# EAGLE schematic soundrasp_module (EAGLE 6.5.0)
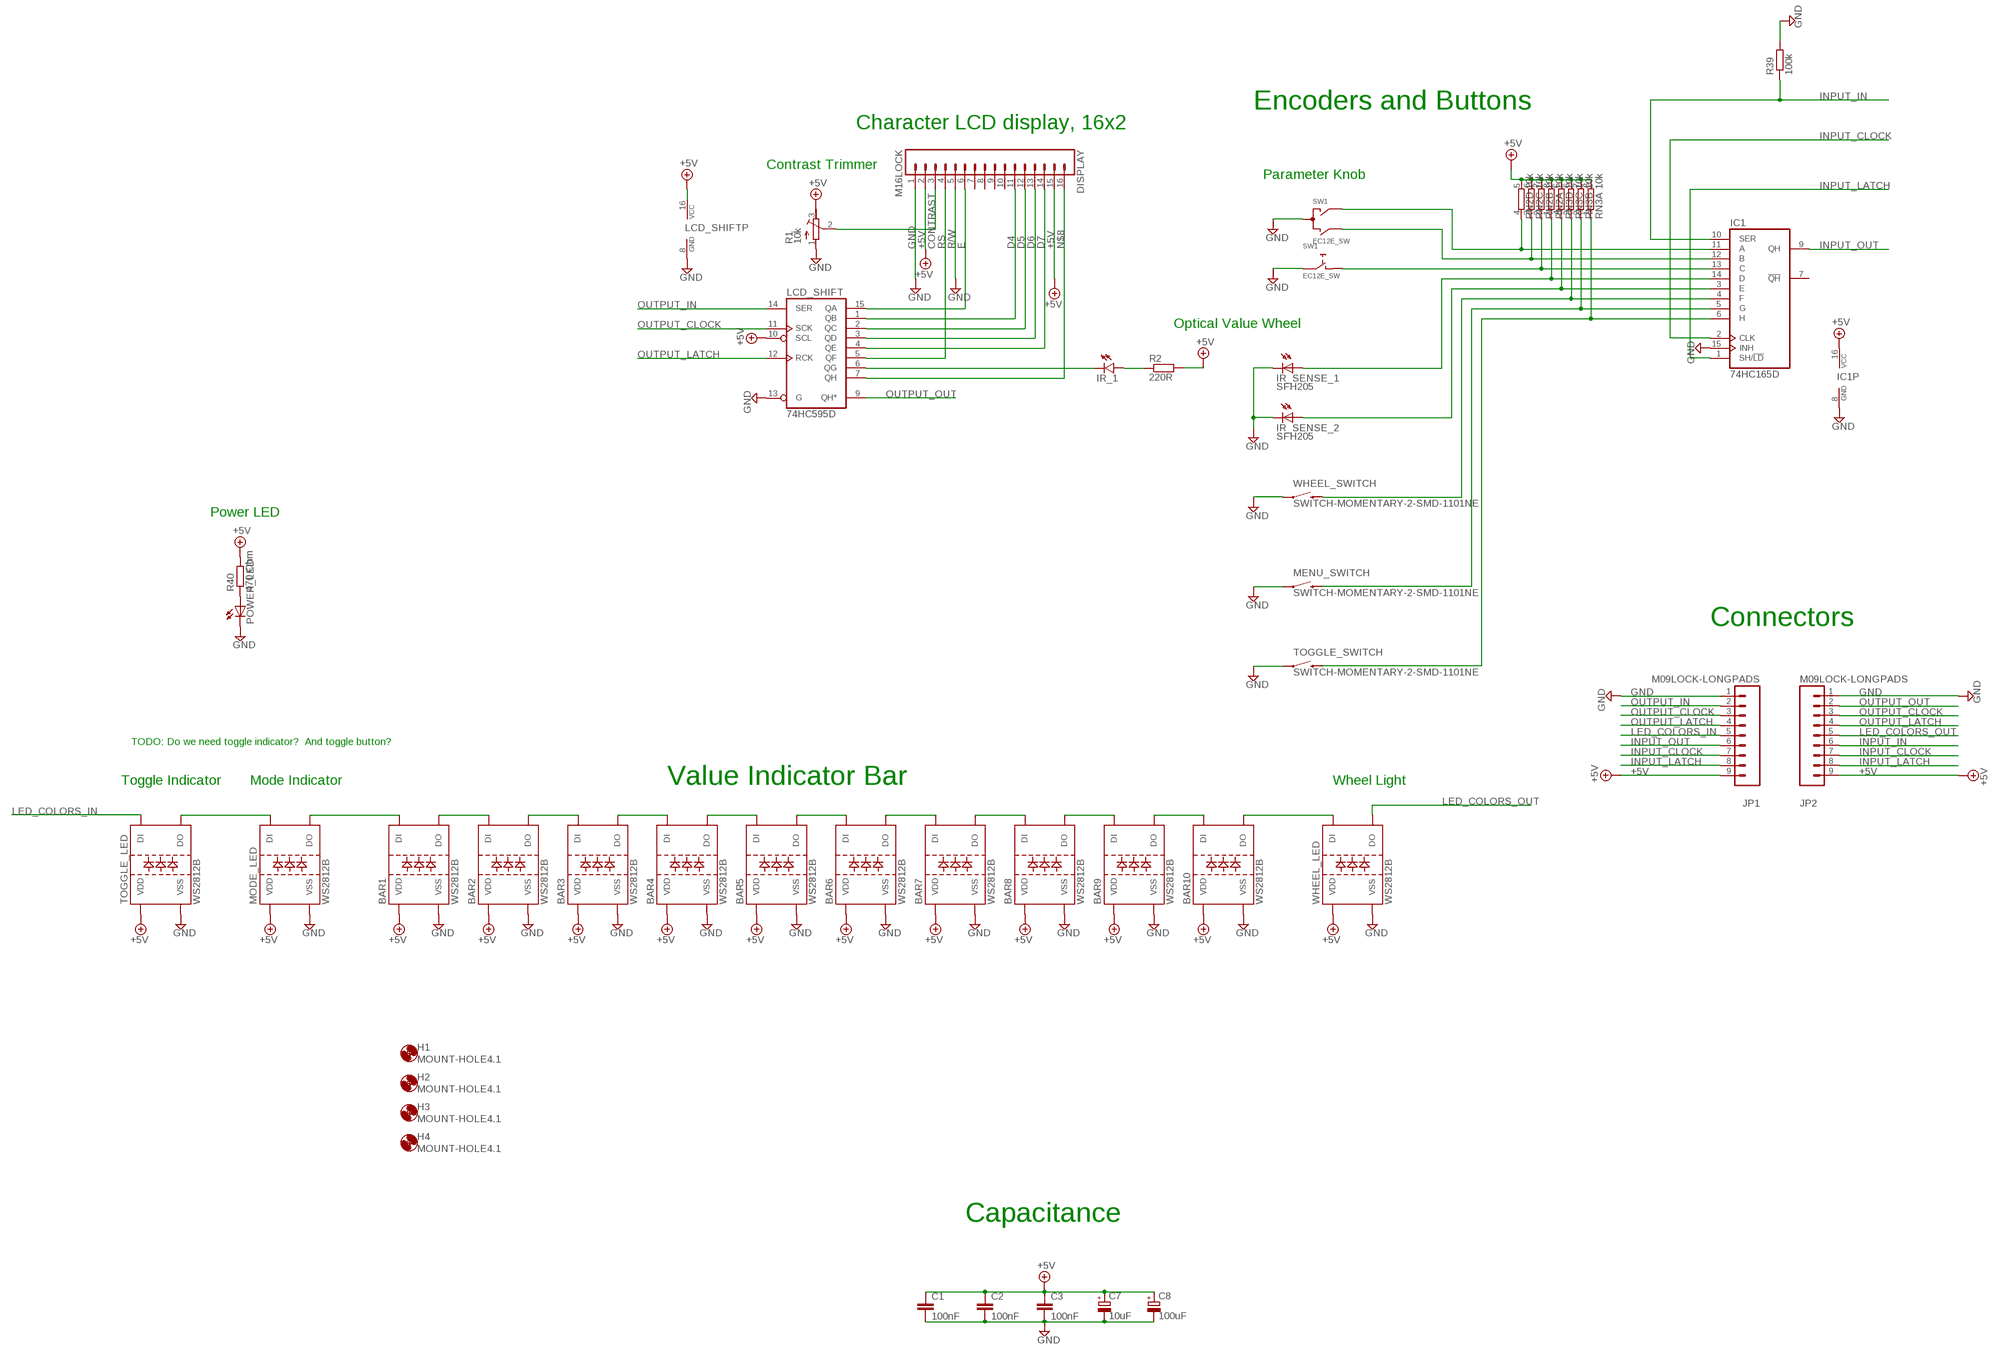
[diagram p0: schematic, sheet 1]

## Parts
BAR1  WS2812B  [WS2812B]
BAR2  WS2812B  [WS2812B]
BAR3  WS2812B  [WS2812B]
BAR4  WS2812B  [WS2812B]
BAR5  WS2812B  [WS2812B]
BAR6  WS2812B  [WS2812B]
BAR7  WS2812B  [WS2812B]
BAR8  WS2812B  [WS2812B]
BAR9  WS2812B  [WS2812B]
BAR10  WS2812B  [WS2812B]
C1  100nF  C-EUC0805  [C0805]
C2  100nF  C-EUC0805  [C0805]
C3  100nF  C-EUC0805  [C0805]
C7  10uF  CPOL-EUE2.5-7  [E2,5-7]
C8  100uF  CPOL-EUE2.5-7  [E2,5-7]
DISPLAY  M16LOCK  [1X16_LOCK]
H1  MOUNT-HOLE4.1  [4,1]
H2  MOUNT-HOLE4.1  [4,1]
H3  MOUNT-HOLE4.1  [4,1]
H4  MOUNT-HOLE4.1  [4,1]
IC1  74HC165D  [SO16]
IR_1  LED3MM  [LED3MM]
IR_SENSE_1  SFH205  [SFH205]
IR_SENSE_2  SFH205  [SFH205]
JP1  M09LOCK-LONGPADS  [1X09_LOCK_LONGPADS]
JP2  M09LOCK-LONGPADS  [1X09_LOCK_LONGPADS]
LCD_SHIFT  74HC595D  [SO16]
MENU_SWITCH  SWITCH-MOMENTARY-2-SMD-1101NE  [TACTILE-SWITCH-1101NE]
MODE_LED  WS2812B  [WS2812B]
POWER_LED  LEDCHIPLED_0805  [CHIPLED_0805]
R1  10k  R-TRIMM3296W  [RTRIM3296W]
R2  220R  R-EU_R0805  [R0805]
R39  100k  R-EU_R0805  [R0805]
R40  470 Ohm  R-EU_R0805  [R0805]
RN2  10k  4R-N0603-ARV  [0603-ARV]
RN3  10k  4R-N0603-ARV  [0603-ARV]
SW1  EC12E_SW  [ALPS_EC12E_SW]
TOGGLE_LED  WS2812B  [WS2812B]
TOGGLE_SWITCH  SWITCH-MOMENTARY-2-SMD-1101NE  [TACTILE-SWITCH-1101NE]
WHEEL_LED  WS2812B  [WS2812B]
WHEEL_SWITCH  SWITCH-MOMENTARY-2-SMD-1101NE  [TACTILE-SWITCH-1101NE]

## Nets
+5V: BAR1.1(VDD) BAR2.1(VDD) BAR3.1(VDD) BAR4.1(VDD) BAR5.1(VDD) BAR6.1(VDD) BAR7.1(VDD) BAR8.1(VDD) BAR9.1(VDD) BAR10.1(VDD) C1.1 C2.1 C3.1 C7.+ C8.+ DISPLAY.2 DISPLAY.15 IC1.16(VCC) JP1.9 JP2.9 LCD_SHIFT.10(SCL) LCD_SHIFT.16(VCC) MODE_LED.1(VDD) R1.3(E) R2.2 R40.2 RN2.5 RN2.6 RN2.7 RN2.8 RN3.5 RN3.6 RN3.7 RN3.8 TOGGLE_LED.1(VDD) WHEEL_LED.1(VDD)
BAR7: BAR6.2(DO) BAR7.4(DI)
CONTRAST: DISPLAY.3 R1.2(S)
D4: DISPLAY.11 LCD_SHIFT.1(QB)
D5: DISPLAY.12 LCD_SHIFT.2(QC)
D6: DISPLAY.13 LCD_SHIFT.3(QD)
D7: DISPLAY.14 LCD_SHIFT.4(QE)
E: DISPLAY.6 LCD_SHIFT.15(QA)
GND: BAR1.3(VSS) BAR2.3(VSS) BAR3.3(VSS) BAR4.3(VSS) BAR5.3(VSS) BAR6.3(VSS) BAR7.3(VSS) BAR8.3(VSS) BAR9.3(VSS) BAR10.3(VSS) C1.2 C2.2 C3.2 C7.- C8.- DISPLAY.1 IC1.8(GND) IC1.15(INH) IR_SENSE_1.K(C) IR_SENSE_2.K(C) JP1.1 JP2.1 LCD_SHIFT.8(GND) LCD_SHIFT.13(G) MENU_SWITCH.P$1 MODE_LED.3(VSS) POWER_LED.C R1.1(A) R39.2 SW1.C SW1.E TOGGLE_LED.3(VSS) TOGGLE_SWITCH.P$1 WHEEL_LED.3(VSS) WHEEL_SWITCH.P$1
INPUT_CLOCK: IC1.2(CLK) JP1.7 JP2.7
INPUT_IN: IC1.10(SER) JP2.6 R39.1
INPUT_LATCH: IC1.1(SH/!LD) JP1.8 JP2.8
INPUT_OUT: IC1.9(QH) JP1.6
LED_COLORS_IN: JP1.5 TOGGLE_LED.4(DI)
LED_COLORS_OUT: JP2.5 WHEEL_LED.2(DO)
N$1: IR_1.A R2.1
N$2: IC1.11(A) RN2.4 SW1.A
N$3: IC1.12(B) RN2.3 SW1.B
N$4: IC1.14(D) IR_SENSE_1.A RN2.1
N$5: IC1.3(E) IR_SENSE_2.A RN3.4
N$6: IC1.13(C) RN2.2 SW1.D
N$7: IC1.4(F) RN3.3 WHEEL_SWITCH.P$2
N$8: DISPLAY.16 LCD_SHIFT.7(QH)
N$9: BAR8.2(DO) BAR9.4(DI)
N$10: BAR9.2(DO) BAR10.4(DI)
N$11: BAR10.2(DO) WHEEL_LED.4(DI)
N$12: MODE_LED.4(DI) TOGGLE_LED.2(DO)
N$13: BAR1.4(DI) MODE_LED.2(DO)
N$15: IR_1.K(C) LCD_SHIFT.6(QG)
N$22: BAR1.2(DO) BAR2.4(DI)
N$23: BAR2.2(DO) BAR3.4(DI)
N$26: BAR3.2(DO) BAR4.4(DI)
N$27: BAR4.2(DO) BAR5.4(DI)
N$28: BAR5.2(DO) BAR6.4(DI)
N$30: BAR7.2(DO) BAR8.4(DI)
N$50: IC1.5(G) MENU_SWITCH.P$2 RN3.2
N$73: POWER_LED.A R40.1
N$80: IC1.6(H) RN3.1 TOGGLE_SWITCH.P$2
OUTPUT_CLOCK: JP1.3 JP2.3 LCD_SHIFT.11(SCK)
OUTPUT_IN: JP1.2 LCD_SHIFT.14(SER)
OUTPUT_LATCH: JP1.4 JP2.4 LCD_SHIFT.12(RCK)
OUTPUT_OUT: JP2.2 LCD_SHIFT.9(QH*)
R/W: DISPLAY.5 ; supply symbol labelled GND
RS: DISPLAY.4 LCD_SHIFT.5(QF)
Unconnected: DISPLAY.7 DISPLAY.8 DISPLAY.9 DISPLAY.10 IC1.7(!QH) SW1.GND1(G) SW1.GND2(G)

## Notes on the sheet
- Encoders and Buttons
- Character LCD display, 16x2
- Contrast Trimmer
- Parameter Knob
- Optical Value Wheel
- Power LED
- Connectors
- TODO: Do we need toggle indicator?  And toggle button?
- Toggle Indicator | Mode Indicator | Value Indicator Bar | Wheel Light
- Capacitance

## Library data of the parts
BAR1-BAR10 MODE_LED TOGGLE_LED WHEEL_LED = WS2812:WS2812B
C1-C3 = rcl:C-EU: CAPACITOR, European symbol
C7 C8 = rcl:CPOL-EU: POLARIZED CAPACITOR, European symbol
DISPLAY = SparkFun-Connectors:M16: 1x16 .1" header
H1-H4 = holes:MOUNT-HOLE: MOUNTING HOLE with drill center marker
IC1 = 74xx-eu:74*165: 8-bit parallel load SHIFT REGISTER
IR_1 = SparkFun-LED:LED: LEDs Standard schematic elements and footprints for 5mm, 3mm, 1206, and 0603 sized LEDs. 5mm - Spark Fun Electronics SKU : COM-00529 (and others)
IR_SENSE_1 IR_SENSE_2 = opto-trans-siemens:SFH205: PHOTO DIODE; OC_FARNELL: unknown; OC_NEWARK: unknown
JP1 JP2 = SparkFun:M09: Header 9 Standard 9-pin 0.1" header. Use with straight break away headers (SKU : PRT-00116), right angle break away headers (PRT-00553), swiss pins (PRT-00743), machine pins (PRT-00117), and female headers (PRT-00115).
LCD_SHIFT = 74xx-eu:74*595: 8-bit SHIFT REGISTER, output latch
MENU_SWITCH TOGGLE_SWITCH WHEEL_SWITCH = SparkFun-Electromechanical:SWITCH-MOMENTARY-2: Various NO switches- pushbuttons, reed, etc
POWER_LED = led:LED: LED OSRAM: - CHIPLED LG R971, LG N971, LY N971, LG Q971, LY Q971, LO R971, LY R971 LH N974, LH R974 LS Q976, LO Q976, LY Q976 LO Q996 - Hyper CHIPLED LW Q18S LB Q993, LB Q99A, LB R99A - SideLED LS A670, LO A670, LY A670, LG A670, LP A670 LB A673, LV A673, LT A673, LW A673 LH A674 LY A675 LS A676, LA A676, LO A676, LY A676, LW A676 LS A679, LY A679, LG A679 - Hyper Micro SIDELED® LS Y876, LA Y876, LO Y876, LY Y876 LT Y87S - SmartLED LW L88C, LW L88S LB L89C, LB L89S, LG L890 LS L89K, LO L89K, LY L89K LS L896, LA L896, LO L896, LY L896 - TOPLED LS T670, LO T670, LY T670, LG T670, LP T670 LSG T670, LSP T670, LSY T670, LOP T670, LYG T670 LG T671, LOG T671, LSG T671 LB T673, LV T673, LT T673, LW T673 LH T674 LS T676, LA T676, LO T676, LY T676, LB T676, LH T676, LSB T676, LW T676 LB T67C, LV T67C, LT T67C, LS T67K, LO T67K, LY T67K, LW E67C LS E67B, LA E67B, LO E67B, LY E67B, LB E67C, LV E67C, LT E67C LW T67C LS T679, LY T679, LG T679 LS T770, LO T770, LY T770, LG T770, LP T770 LB T773, LV T773, LT T773, LW T773 LH T774 LS E675, LA E675, LY E675, LS T675 LS T776, LA T776, LO T776, LY T776, LB T776 LHGB T686 LT T68C, LB T68C - Hyper Mini TOPLED® LB M676 - Mini TOPLED Santana® LG M470 LS M47K, LO M47K, LY M47K Source: http://www.osram.convergy.de LUXEON: - LUMILED® LXK2-PW12-R00, LXK2-PW12-S00, LXK2-PW14-U00, LXK2-PW14-V00 LXK2-PM12-R00, LXK2-PM12-S00, LXK2-PM14-U00 LXK2-PE12-Q00, LXK2-PE12-R00, LXK2-PE12-S00, LXK2-PE14-T00, LXK2-PE14-U00 LXK2-PB12-K00, LXK2-PB12-L00, LXK2-PB12-M00, LXK2-PB14-N00, LXK2-PB14-P00, LXK2-PB14-Q00 LXK2-PR12-L00, LXK2-PR12-M00, LXK2-PR14-Q00, LXK2-PR14-R00 LXK2-PD12-Q00, LXK2-PD12-R00, LXK2-PD12-S00 LXK2-PH12-R00, LXK2-PH12-S00 LXK2-PL12-P00, LXK2-PL12-Q00, LXK2-PL12-R00 Source: www.luxeon.com KINGBRIGHT: KA-3528ASYC Source: www.kingbright.com
R1 = rcl:R-TRIMM: Trimm resistor
R2 R39 R40 = rcl:R-EU_: RESISTOR, European symbol
RN2 RN3 = resistor-dil:4R-N: Array Chip Resistor Source: RS Component / Phycomp; OC_FARNELL: unknown; OC_NEWARK: unknown
SW1 = switch-alps:EC12E_SW: ALPS rotary Encoder EC12E series with switch; MPN: EC12E2424407; OC_FARNELL: 1520813; OC_NEWARK: 74M1068